# EAGLE design proper (EAGLE 7.5.0)
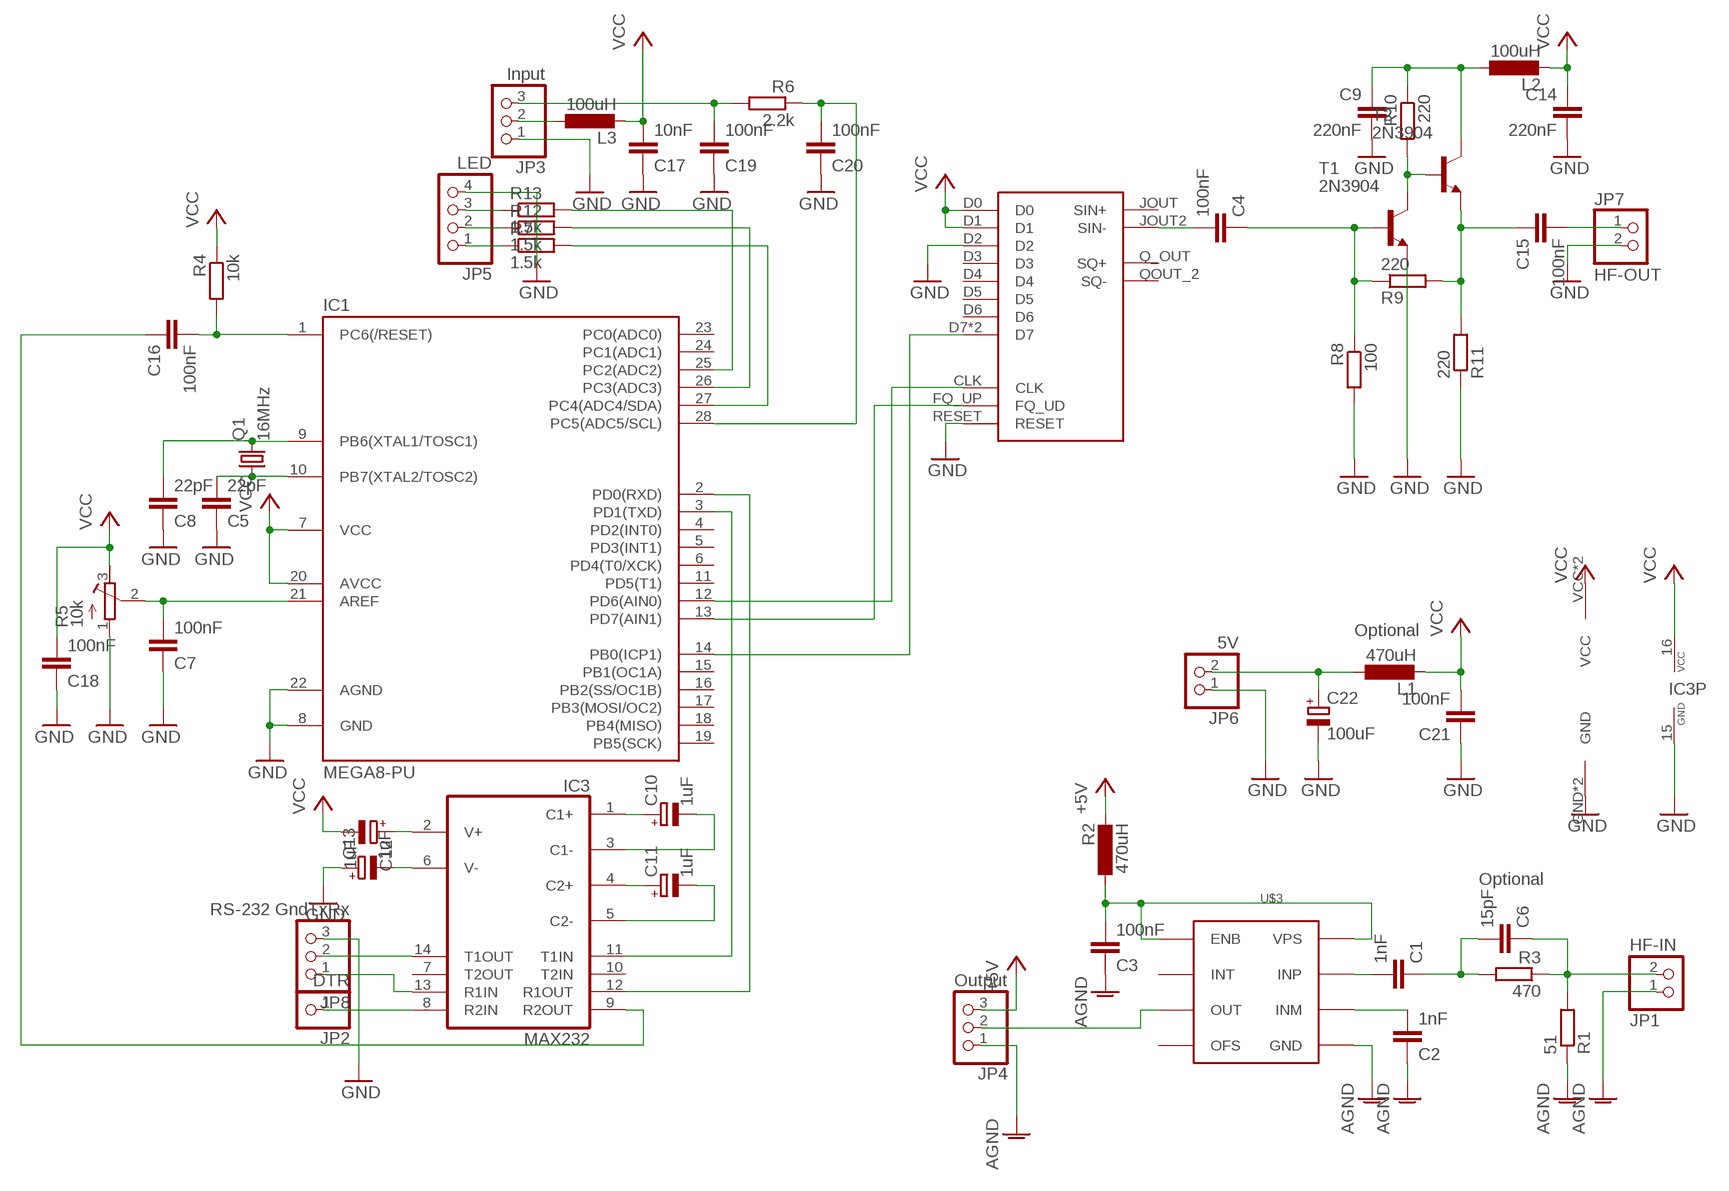
[diagram p0: schematic, sheet 1]

## Parts
C1  1nF  C-EU025-025X050  [C025-025X050]
C2  1nF  C-EU025-025X050  [C025-025X050]
C3  100nF  C-EU025-025X050  [C025-025X050]
C4  100nF  C-EU025-025X050  [C025-025X050]
C5  22pF  C-EU102-043X133  [C102-043X133]
C6  15pF  C-EU050-025X075  [C050-025X075]
C7  100nF  C-EU025-025X050  [C025-025X050]
C8  22pF  C-EU025-025X050  [C025-025X050]
C9  220nF  C-EU025-025X050  [C025-025X050]
C10  1uF  CPOL-EUE2.5-5  [E2,5-5]
C11  1uF  CPOL-EUE2.5-5  [E2,5-5]
C12  1uF  CPOL-EUE2.5-5  [E2,5-5]
C13  1uF  CPOL-EUE2.5-5  [E2,5-5]
C14  220nF  C-EU050-025X075  [C050-025X075]
C15  100nF  C-EU050-025X075  [C050-025X075]
C16  100nF  C-EU075-032X103  [C075-032X103]
C17  10nF  C-EU025-025X050  [C025-025X050]
C18  100nF  C-EU050-025X075  [C050-025X075]
C19  100nF  C-EU025-025X050  [C025-025X050]
C20  100nF  C-EU025-025X050  [C025-025X050]
C21  100nF  C-EU025-025X050  [C025-025X050]
C22  100uF  CPOL-EUE2.5-6  [E2,5-6]
IC1  MEGA8-PU  [DIL28-3]
IC3  MAX232  [DIL16]
JP1  HF-IN  PINHD-1X2  [1X02]
JP2  DTR  PINHD-1X1  [1X01]
JP3  Input  PINHD-1X3  [1X03]
JP4  Output  PINHD-1X3  [1X03]
JP5  LED  PINHD-1X4  [1X04]
JP6  5V  PINHD-1X2  [1X02]
JP7  HF-OUT  PINHD-1X2  [1X02]
JP8  RS-232 GndTxRx  PINHD-1X3  [1X03]
L1  470uH  L-EU0207/5V  [0207/5V]
L2  100uH  L-EU0207/12  [0207/12]
L3  100uH  L-EU0207/2V  [0207/2V]
Q1  16MHz  CRYSTALHC49U-V  [HC49U-V]
R1  51  R-EU_0204/2V  [0204V]
R2  470uH  L-EU0204/5  [0204/5]
R3  470  R-EU_0204/5  [0204/5]
R4  10k  R-EU_0204/5  [0204/5]
R5  10k  R-TRIMM64W  [RTRIM64W]
R6  2.2k  R-EU_0204/2V  [0204V]
R7  1.5k  R-EU_0204/5  [0204/5]
R8  100  R-EU_0204/2V  [0204V]
R9  220  R-EU_0204/2V  [0204V]
R10  220  R-EU_0204/2V  [0204V]
R11  220  R-EU_0204/2V  [0204V]
R12  1.5k  R-EU_0204/5  [0204/5]
R13  1.5k  R-EU_0204/5  [0204/5]
T1  2N3904  2N3904-NPN-TO92-EBC  [TO92-EBC]
T2  2N3904  2N3904-NPN-TO92-EBC  [TO92-EBC]
U$1  DDS-1  [DDS-1]
U$3  AD8307  [DIL08]

## Nets
+5V: JP4.3 R2.2
GND: C5.1 C7.1 C8.1 C9.2 C13.+ C14.2 C17.1 C18.1 C19.1 C20.1 C21.1 C22.- IC1.8(GND) IC1.22(AGND) IC3.15(GND) JP3.1 JP5.4 JP6.1 JP7.2 JP8.3 R5.1(A) R8.2 R11.1 T1.E U$1.D2 U$1.GND U$1.GND2(GND) U$1.RESET
N$1: C4.2 U$1.JOUT2(SIN-)
N$2: C6.1 JP1.2 R1.2 R3.1
N$3: C1.2 U$3.8(INP)
N$4: C2.2 U$3.1(INM)
N$5: C5.2 IC1.10(PB7(XTAL2/TOSC2)) Q1.1
N$6: C8.2 IC1.9(PB6(XTAL1/TOSC1)) Q1.2
N$7: C12.+ IC3.2(V+)
N$8: C3.2 R2.1 U$3.6(ENB) U$3.7(VPS)
N$9: JP4.2 U$3.4(OUT)
N$10: C22.+ JP6.2 L1.1
N$11: IC3.14(T1OUT) JP8.2
N$12: C1.1 C6.2 R3.2
N$13: C4.1 R8.1 R9.1 T1.B
N$14: C20.2 IC1.28(PC5(ADC5/SCL)) R6.1
N$15: IC1.13(PD7(AIN1)) U$1.FQ_UP(FQ_UD)
N$16: C13.- IC3.6(V-)
N$17: IC1.3(PD1(TXD)) IC3.11(T1IN)
N$18: IC1.12(PD6(AIN0)) U$1.CLK
N$19: IC1.14(PB0(ICP1)) U$1.D7 U$1.D7_2(D7)
N$20: C9.1 L2.1 R10.1 T2.C
N$21: R10.2 T1.C T2.B
N$22: IC1.2(PD0(RXD)) IC3.12(R1OUT)
N$23: C15.2 JP7.1
N$24: C15.1 R9.2 R11.2 T2.E
N$25: C16.2 IC1.1(PC6(/RESET)) R4.2
N$26: C16.1 IC3.9(R2OUT)
N$27: IC3.8(R2IN) JP2.1
N$28: C7.2 IC1.21(AREF) R5.2(S)
N$29: JP3.2 L3.1
N$30: JP5.1 R7.1
N$31: JP5.2 R12.1
N$32: JP5.3 R13.1
N$33: C2.1 C3.1 JP1.1 JP4.1 R1.1 U$3.2(GND) ; supply symbol labelled AGND
N$34: IC3.13(R1IN) JP8.1
N$35: IC1.27(PC4(ADC4/SDA)) R7.2
N$36: IC1.26(PC3(ADC3)) R12.2
N$37: IC1.25(PC2(ADC2)) R13.2
N$38: C10.+ IC3.1(C1+)
N$39: C10.- IC3.3(C1-)
N$40: C11.+ IC3.4(C2+)
N$41: C11.- IC3.5(C2-)
N$42: C19.2 JP3.3 R6.2
VCC: C12.- C14.1 C17.2 C18.2 C21.2 IC1.7(VCC) IC1.20(AVCC) IC3.16(VCC) L1.2 L2.2 L3.2 R4.1 R5.3(E) U$1.D0 U$1.D1 U$1.VCC U$1.VCC2(VCC)
Unconnected: IC1.4(PD2(INT0)) IC1.5(PD3(INT1)) IC1.6(PD4(T0/XCK)) IC1.11(PD5(T1)) IC1.15(PB1(OC1A)) IC1.16(PB2(SS/OC1B)) IC1.17(PB3(MOSI/OC2)) IC1.18(PB4(MISO)) IC1.19(PB5(SCK)) IC1.23(PC0(ADC0)) IC1.24(PC1(ADC1)) IC3.7(T2OUT) IC3.10(T2IN) U$1.D3 U$1.D4 U$1.D5 U$1.D6 U$1.JOUT(SIN+) U$1.Q_OUT(SQ+) U$1.QOUT_2(SQ-) U$3.3(OFS) U$3.5(INT)

## Notes on the sheet
- Optional
- Optional

## Library data of the parts
C1-C9 C14-C21 = rcl:C-EU: CAPACITOR, European symbol
C10-C13 C22 = rcl:CPOL-EU: POLARIZED CAPACITOR, European symbol
IC1 = avr-6:MEGA8-PU
IC3 = maxim:MAX232: RS232 TRANSCEIVER; MF: MAXIM; MPN: MAX232ACPE+; OC_FARNELL: 9723773; OC_NEWARK: 68K4544
JP1 JP6 JP7 = pinhead:PINHD-1X2: PIN HEADER
JP2 = pinhead:PINHD-1X1: PIN HEADER
JP3 JP4 JP8 = pinhead:PINHD-1X3: PIN HEADER
JP5 = pinhead:PINHD-1X4: PIN HEADER
L1-L3 R2 = rcl:L-EU: INDUCTOR, European symbol
Q1 = crystal:CRYSTAL: CRYSTAL; OC_FARNELL: 1666969; OC_NEWARK: unknown
R1 R3 R4 R6-R13 = rcl:R-EU_: RESISTOR, European symbol
R5 = rcl:R-TRIMM: Trimm resistor
T1 T2 = transistor-neu-to92:*-NPN-: NPN Transistror
U$1 = minikits:DDS-1: DDS-1 Module DDS module by minikits.au
U$3 = -- Eigene:AD8307

## Board
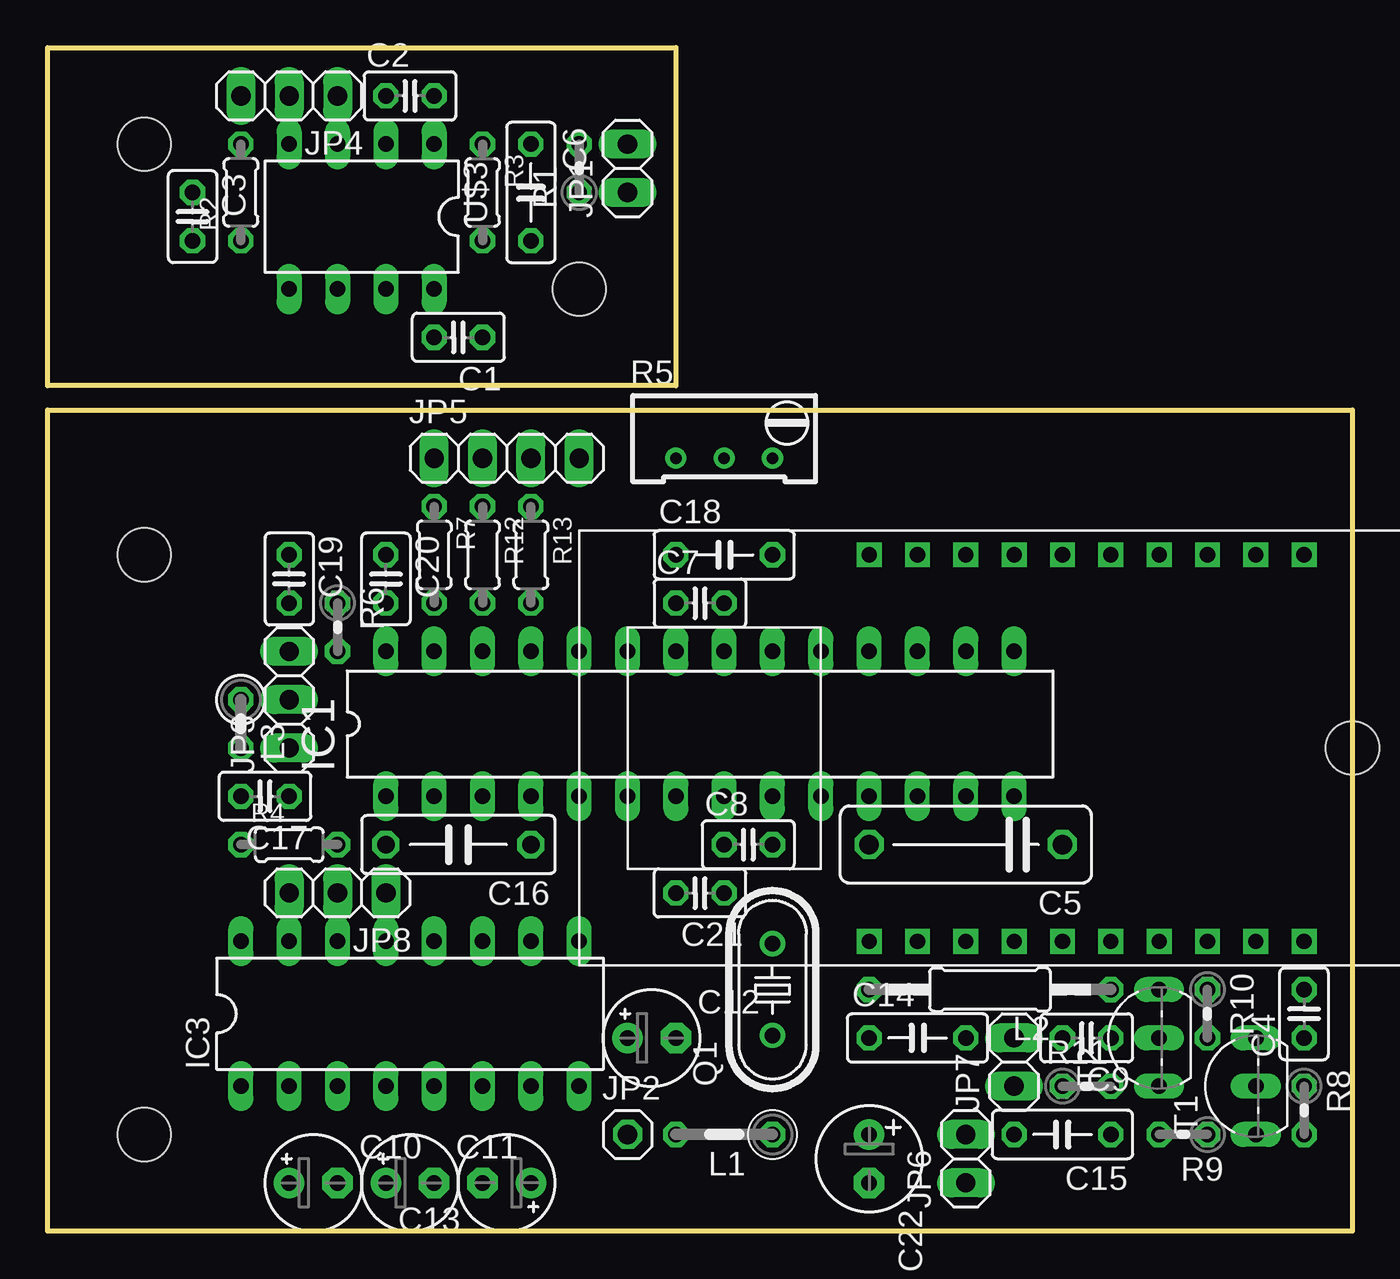
[diagram p1: board, top side]
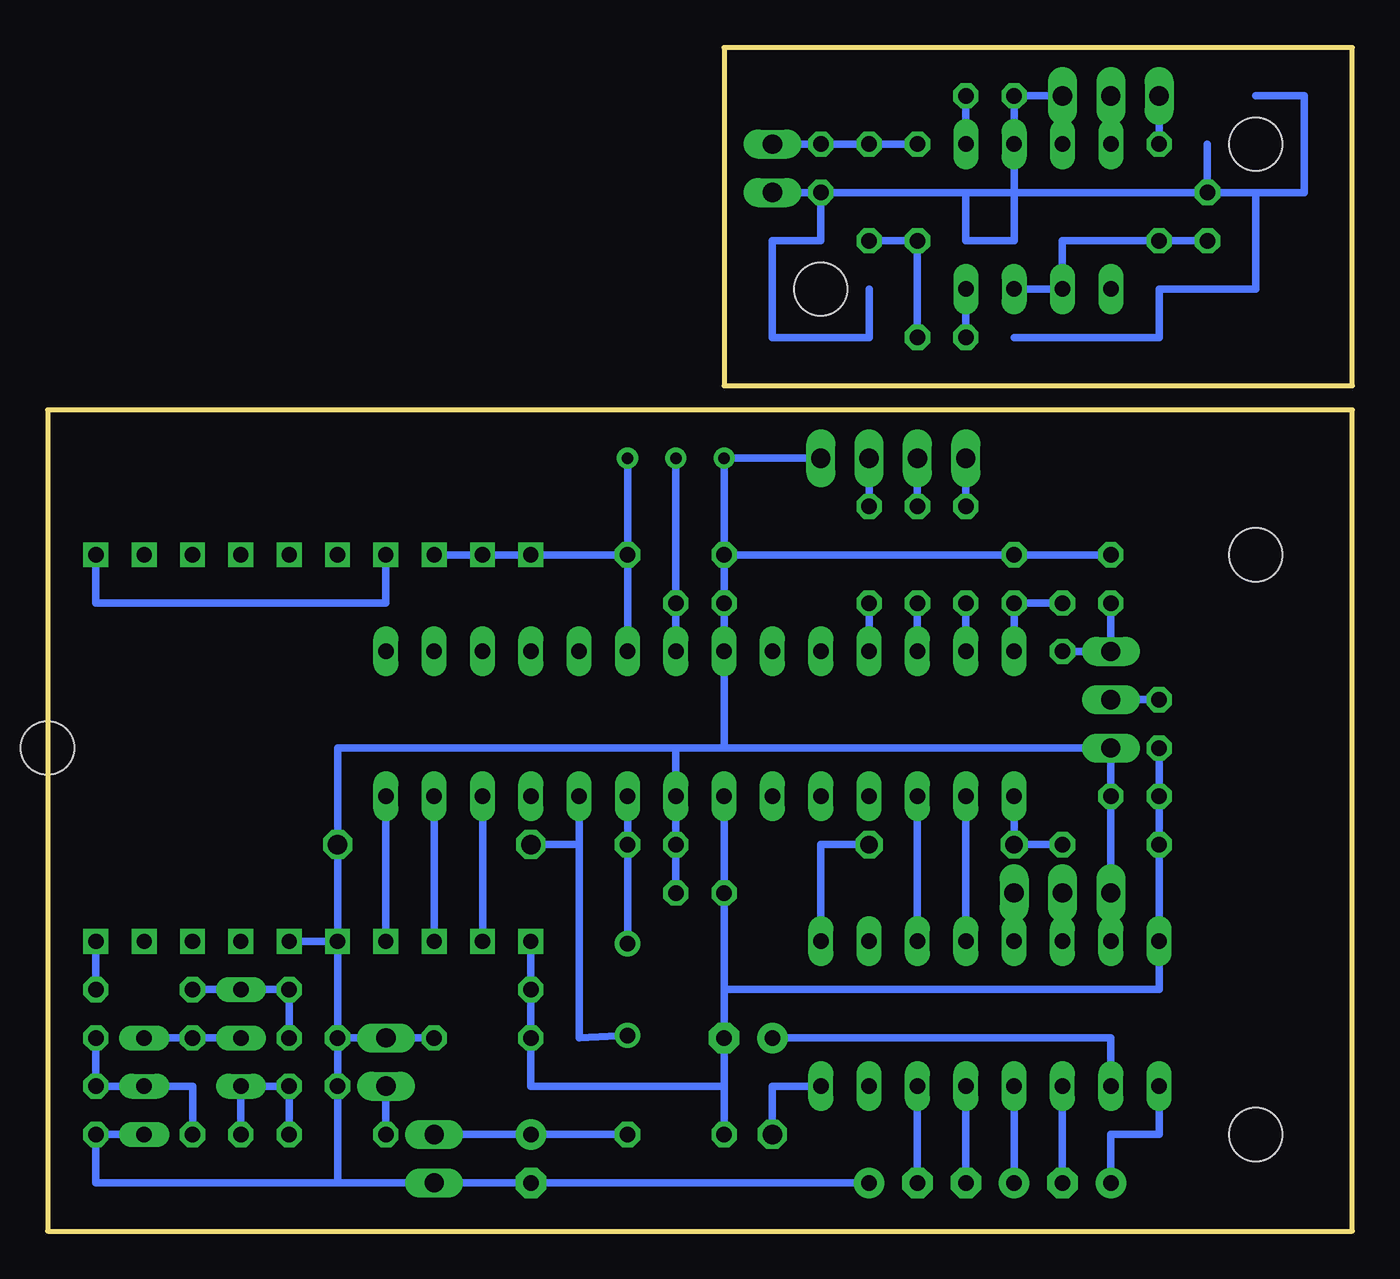
[diagram p2: board, bottom side, seen from below]

Size 68.58 x 62.23 mm. Coordinates in mm from the lower left corner, seen from the top.
Outline: 33.02,62.23 33.02,44.45 0,44.45 0,62.23 33.02,62.23
Outline: 0,0 0,43.18 68.58,43.18 68.58,0 0,0
Copper layers (1*16): Top 0.035mm / dielectric 1.5mm / Bottom 0.035mm
Design rules "default": minimum track width 10mil, minimum drill 24mil, track to track 8mil, track to pad 8mil, pad to pad 8mil, via to via 8mil, smd to smd 8mil, copper to edge 40mil, drill to drill 8mil, minimum pad ring 10mil, minimum via ring 8mil, stop-mask expansion 4mil, vias tented up to drill 0mil, thermal gap 10mil
Holes 2.8 mm at 68.58,25.4 5.08,35.56 27.94,49.53 5.08,57.15 5.08,5.08

### Footprints (pad centres in the part's own frame; a part is rotated, then mirrored left to right if it is on the bottom)
C025-025X050 = drill 0.813 octagon: 1 -1.27,0; 2 1.27,0
C102-043X133 = drill 1.016 octagon: 1 -5.08,0; 2 5.08,0
C050-025X075 = drill 0.813 octagon: 1 -2.54,0; 2 2.54,0
E2,5-5 = drill 0.813 pad 1.6: + -1.27,0 | drill 0.813 pad 1.6 octagon: - 1.27,0
C075-032X103 = drill 0.914 octagon: 1 -3.81,0; 2 3.81,0
E2,5-6 = drill 0.813 pad 1.6: + -1.27,0 | drill 0.813 pad 1.6 octagon: - 1.27,0
DIL28-3 = drill 0.813 long: 1 -16.51,-3.81; 2 -13.97,-3.81; 3 -11.43,-3.81; 4 -8.89,-3.81; 5 -6.35,-3.81; 6 -3.81,-3.81; 7 -1.27,-3.81; 8 1.27,-3.81; 9 3.81,-3.81; 10 6.35,-3.81; 11 8.89,-3.81; 12 11.43,-3.81; 13 13.97,-3.81; 14 16.51,-3.81; 15 16.51,3.81; 16 13.97,3.81; 17 11.43,3.81; 18 8.89,3.81; 19 6.35,3.81; 20 3.81,3.81; 21 1.27,3.81; 22 -1.27,3.81; 23 -3.81,3.81; 24 -6.35,3.81; 25 -8.89,3.81; 26 -11.43,3.81; 27 -13.97,3.81; 28 -16.51,3.81
DIL16 = drill 0.813 long: 1 -8.89,-3.81; 2 -6.35,-3.81; 3 -3.81,-3.81; 4 -1.27,-3.81; 5 1.27,-3.81; 6 3.81,-3.81; 7 6.35,-3.81; 8 8.89,-3.81; 9 8.89,3.81; 10 6.35,3.81; 11 3.81,3.81; 12 1.27,3.81; 13 -1.27,3.81; 14 -3.81,3.81; 15 -6.35,3.81; 16 -8.89,3.81
1X02 = drill 1.016 long: 1 -1.27,0; 2 1.27,0
1X01 = drill 1.016 octagon: 1 0,0
1X03 = drill 1.016 long: 1 -2.54,0; 2 0,0; 3 2.54,0
1X04 = drill 1.016 long: 1 -3.81,0; 2 -1.27,0; 3 1.27,0; 4 3.81,0
0207/5V = drill 0.813 octagon: 1 -2.54,0; 2 2.54,0
0207/12 = drill 0.813 octagon: 1 -6.35,0; 2 6.35,0
0207/2V = drill 0.813 octagon: 1 -1.27,0; 2 1.27,0
HC49U-V = drill 0.813: 1 -2.413,0; 2 2.413,0
0204V = drill 0.813 octagon: 1 -1.27,0; 2 1.27,0
0204/5 = drill 0.813 octagon: 1 -2.54,0; 2 2.54,0
RTRIM64W = drill 0.61: 1 1.27,-2.54; 2 1.27,0; 3 1.27,2.54
TO92-EBC = drill 0.813 long: B 0,-1.27; C 2.54,-1.27; E -2.54,-1.27
DDS-1 = drill 0.8 square: CLK -11.43,7.62; D0 8.89,7.62; D1 8.89,5.08; D2 8.89,2.54; D3 8.89,0; D4 8.89,-2.54; D5 8.89,-5.08; D6 8.89,-7.62; D7 -11.43,2.54; D7_2 8.89,-10.16; FQ_UP -11.43,5.08; GND -11.43,-2.54; GND2 8.89,-12.7; JOUT -11.43,-10.16; JOUT2 -11.43,-12.7; Q_OUT -11.43,-5.08; QOUT_2 -11.43,-7.62; RESET -11.43,0; VCC -11.43,10.16; VCC2 8.89,10.16
DIL08 = drill 0.813 long: 1 -3.81,-3.81; 2 -1.27,-3.81; 3 1.27,-3.81; 4 3.81,-3.81; 5 3.81,3.81; 6 1.27,3.81; 7 -1.27,3.81; 8 -3.81,3.81

### Placement (x,y rotation side)
C1  21.59,46.99 180 top
C2  19.05,59.69 0 top
C3  7.62,53.34 270 top
C4  66.04,11.43 90 top
C5  48.26,20.32 180 top
C6  25.4,54.61 270 top
C7  34.29,33.02 0 top
C8  36.83,20.32 0 top
C9  54.61,10.16 180 top
C10  13.97,2.54 0 top
C11  19.05,2.54 0 top
C12  31.75,10.16 0 top
C13  24.13,2.54 180 top
C14  45.72,10.16 0 top
C15  53.34,5.08 180 top
C16  21.59,20.32 180 top
C17  11.43,22.86 180 top
C18  35.56,35.56 0 top
C19  12.7,34.29 270 top
C20  17.78,34.29 270 top
C21  34.29,17.78 180 top
C22  43.18,3.81 270 top
IC1  34.29,26.67 0 top
IC3  19.05,11.43 0 top
JP1  30.48,55.88 90 top
JP2  30.48,5.08 0 top
JP3  12.7,27.94 90 top
JP4  12.7,59.69 180 top
JP5  24.13,40.64 0 top
JP6  48.26,3.81 90 top
JP7  50.8,8.89 90 top
JP8  15.24,17.78 180 top
L1  35.56,5.08 180 top
L2  49.53,12.7 180 top
L3  10.16,26.67 270 top
Q1  38.1,12.7 90 top
R1  27.94,55.88 90 top
R2  10.16,54.61 90 top
R3  22.86,54.61 270 top
R4  12.7,20.32 0 top
R5  35.56,41.91 270 top
R6  15.24,31.75 270 top
R7  20.32,35.56 270 top
R8  66.04,6.35 270 top
R9  59.69,5.08 180 top
R10  60.96,11.43 270 top
R11  54.61,7.62 0 top
R12  22.86,35.56 270 top
R13  25.4,35.56 270 top
T1  62.23,7.62 90 top
T2  57.15,10.16 90 top
U$1  53.34,26.67 90 top
U$3  16.51,53.34 180 top

### Tracks (layer width: path | path; a pad name or v marks a point on that pad's centre or on a via)
+5V
  Bottom 0.406: JP4.3 R2.2
GND
  Bottom 0.406: IC3.15 JP8.3 C17.1 JP3.1 33.02,25.4 | C13.+ C22.- JP6.1 53.34,2.54 | 35.56,25.4 IC1.8 C8.1 C21.1 | C14.2 JP7.2 C9.2 | 53.34,2.54 R11.1 C9.2 | 35.56,25.4 53.34,25.4 C5.1 U$1.RESET | C9.2 U$1.RESET | U$1.RESET U$1.GND | 35.56,25.4 33.02,25.4 | U$1.GND2 66.04,33.02 50.8,33.02 U$1.D2 | C18.1 C7.1 IC1.22 33.02,25.4 | JP5.4 R5.1 C18.1 | 53.34,2.54 66.04,2.54 R8.2 T1.E | C20.1 C19.1 C18.1
N$1
  Bottom 0.406: U$1.JOUT2 C4.2
N$2
  Bottom 0.406: JP1.2 R1.2 C6.1 R3.1
N$3
  Bottom 0.406: U$3.8 C1.2
N$4
  Bottom 0.406: C2.2 U$3.1
N$5
  Bottom 0.406: IC1.10 40.64,20.32 | 40.64,20.32 40.64,10.16 Q1.1 | C5.2 40.64,20.32
N$6
  Bottom 0.406: Q1.2 C8.2 IC1.9
N$7
  Bottom 0.406: IC3.2 12.7,10.16 C12.+
N$8
  Bottom 0.406: U$3.7 U$3.6 15.24,52.07 R2.1 C3.2
N$9
  Bottom 0.406: JP4.2 U$3.4
N$10
  Bottom 0.406: JP6.2 C22.+ L1.1
N$11
  Bottom 0.406: IC3.14 JP8.2
N$12
  Bottom 0.406: C6.2 R3.2 C1.1
N$13
  Bottom 0.406: C4.1 R8.1 T1.B 60.96,7.62 R9.1
N$14
  Bottom 0.406: IC1.28 C20.2 R6.1
N$15
  Bottom 0.406: IC1.13 U$1.FQ_UP
N$16
  Bottom 0.406: C13.- IC3.6
N$17
  Bottom 0.406: IC1.3 IC3.11
N$18
  Bottom 0.406: IC1.12 U$1.CLK
N$19
  Bottom 0.406: IC1.14 U$1.D7
N$20
  Bottom 0.406: C9.1 L2.1 T2.C R10.1
N$21
  Bottom 0.406: T2.B R10.2 T1.C
N$22
  Bottom 0.406: IC3.12 IC1.2
N$23
  Bottom 0.406: JP7.1 C15.2
N$24
  Bottom 0.406: C15.1 R11.2 T2.E R9.2
N$25
  Bottom 0.406: R4.2 C16.2 IC1.1
N$26
  Bottom 0.406: C16.1 27.94,20.32 IC3.9
N$27
  Bottom 0.406: IC3.8 30.48,7.62 JP2.1
N$28
  Bottom 0.406: IC1.21 C7.2 R5.2
N$29
  Bottom 0.406: JP3.2 L3.1
N$30
  Bottom 0.406: R7.1 JP5.1
N$31
  Bottom 0.406: JP5.2 R12.1
N$32
  Bottom 0.406: R13.1 JP5.3
N$33
  Bottom 0.406: C3.1 5.08,54.61 | 5.08,54.61 2.54,54.61 2.54,59.69 5.08,59.69 | 25.4,49.53 25.4,46.99 30.48,46.99 30.48,52.07 27.94,52.07 R1.1 | JP4.1 C2.1 U$3.2 17.78,54.61 | 17.78,54.61 C3.1 | JP1.1 R1.1 | R1.1 20.32,54.61 | 20.32,54.61 17.78,54.61 | C3.1 7.62,57.15 | 20.32,54.61 20.32,52.07 17.78,52.07 17.78,54.61 | 5.08,54.61 5.08,49.53 10.16,49.53 10.16,46.99 17.78,46.99
N$34
  Bottom 0.406: JP8.1 IC3.13
N$35
  Bottom 0.406: IC1.27 R7.2
N$36
  Bottom 0.406: R12.2 IC1.26
N$37
  Bottom 0.406: IC1.25 R13.2
N$38
  Bottom 0.406: C10.+ 12.7,5.08 10.16,5.08 IC3.1
N$39
  Bottom 0.406: IC3.3 C10.-
N$40
  Bottom 0.406: C11.+ IC3.4
N$41
  Bottom 0.406: IC3.5 C11.-
N$42
  Bottom 0.406: R6.2 JP3.3 C19.2
VCC
  Bottom 0.406: 33.02,12.7 C12.- 33.02,7.62 | L1.2 33.02,7.62 | 33.02,7.62 43.18,7.62 C14.1 L2.2 U$1.VCC | 33.02,12.7 C21.2 IC1.7 | 33.02,12.7 10.16,12.7 IC3.16 R4.1 C17.2 L3.2 | U$1.D1 U$1.D0 U$1.VCC2 C18.2 | C18.2 IC1.20 | R5.3 C18.2